# Altium schematic sheet Echode.SchDoc
size A4
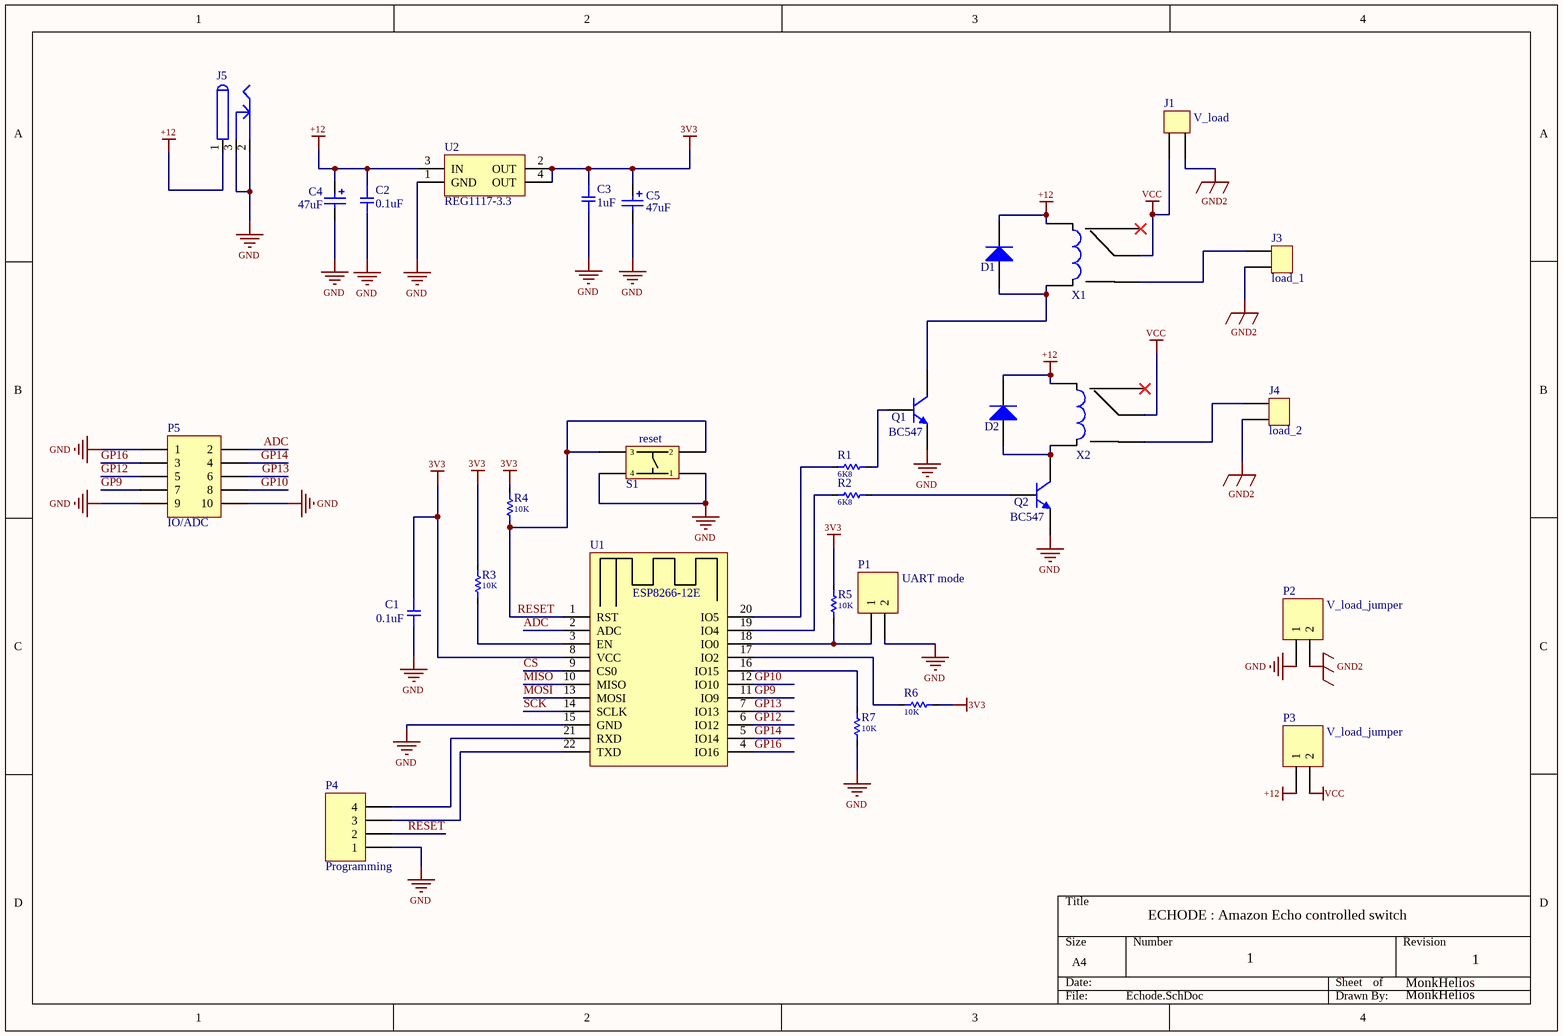
[diagram p0: Echode.SchDoc]

## Parts
C1  0.1uF  [SMD-0805C]
C2  0.1uF  [SMD-0805C]
C3  1uF  [SMD-0805C]
C4  47uF  [PCBComponent_1]
C5  47uF  [PCBComponent_1]
D1  Diode 1N4007  [DO-41]  (value not drawn)
D2  Diode 1N4007  [DO-41]  (value not drawn)
J1  V_load  [Degson_DG126-5.0-02P-14]
J3  load_1  [Degson_DG126-5.0-02P-14]
J4  load_2  [Degson_DG126-5.0-02P-14]
J5  PWR2.5  [KLD-0202]  (value not drawn)
P1  UART mode  [HDR1X2]
P2  V_load_jumper  [HDR1X2]
P3  V_load_jumper  [HDR1X2]
P4  Programming  [HDR1X4]
P5  IO/ADC  [HDR2X5]
Q1  BC547  [SOT-23B_N]
Q2  BC547  [SOT-23B_N]
R1  Component_1  [Resistor_0805]  (value not drawn)
R2  Component_1  [Resistor_0805]  (value not drawn)
R3  Component_1  [Resistor_0805]  (value not drawn)
R4  Component_1  [Resistor_0805]  (value not drawn)
R5  Component_1  [Resistor_0805]  (value not drawn)
R6  Component_1  [Resistor_0805]  (value not drawn)
R7  Component_1  [Resistor_0805]  (value not drawn)
S1  reset  [PCBComponent_1]
U1  ESP8266-12E  [PCBComponent_1]
U2  REG1117-3.3  [ZZ311]
X1  (no value)  [845HN-1C-C]
X2  (no value)  [845HN-1C-C]

## Nets
3V3: C1.1 C3.1 C5.1 R3.2 R4.2 R5.1 R6.1 U1.8(VCC) U2.2(OUT) U2.4(OUT)
+12: C2.1 C4.1 D1.2(K) D2.2(K) J5.1 P3.1 U2.3(IN) X1.1 X2.1
GND: C1.2 C2.2 C3.2 C4.2 C5.2 J5.2 J5.3 P1.2 P2.1 P4.1 P5.1 P5.9 P5.10 Q1.3(E) Q2.3(E) R7.1 S1.1 S1.4 U1.15(GND) U2.1(GND)
GND2: J1.2 J3.2 J4.2 P2.2
VCC: J1.1 P3.2 X1.4 X2.4
ADC: P5.2 U1.2(ADC)
CS: U1.9(CS0)
GP9: P5.7 U1.11(IO9)
GP10: P5.8 U1.12(IO10)
GP12: P5.5 U1.6(IO12)
GP13: P5.6 U1.7(IO13)
GP14: P5.4 U1.5(IO14)
GP16: P5.3 U1.4(IO16)
MISO: U1.10(MISO)
MOSI: U1.13(MOSI)
RESET: P4.2 R4.1 S1.2 S1.3 U1.1(RST)
SCK: U1.14(SCLK)
NetD1_1: D1.1(A) Q1.1(C) X1.2
NetD2_1: D2.1(A) Q2.1(C) X2.2
NetJ3_1: J3.1 X1.5
NetJ4_1: J4.1 X2.5
NetP1_1: P1.1 R5.2 U1.18(IO0)
NetP4_3: P4.3 U1.22(TXD)
NetP4_4: P4.4 U1.21(RXD)
NetQ1_2: Q1.2(B) R1.2
NetQ2_2: Q2.2(B) R2.2
NetR1_1: R1.1 U1.20(IO5)
NetR2_1: R2.1 U1.19(IO4)
NetR3_1: R3.1 U1.3(EN)
NetR6_2: R6.2 U1.17(IO2)
NetR7_2: R7.2 U1.16(IO15)

Not connected (* = marked no-connect by the designer): X1 3*; X2 3*

## Notes on the sheet
- ECHODE : Amazon Echo controlled switch
- 1
- MonkHelios
- (in symbol Component_1) 10K; 6K8

## Library data of the parts
C1-C3 = GC321AD72E103KX01D: CAP CER 10000PF 250V X7T 0805; Manufacturer: Murata Electronics North America; Factory Stock: 0; Unit Price (USD): 0.3; Minimum Quantity: 1; Tolerance: ±10%; Datasheets: http://search.murata.co.jp/Ceramy/image/img/A01X/G101/ENG/GC321AD72E103KX01-01.pdf; Image: //media.digikey.com/Renders/Murata%20Renders/0805(GC3)200x125.jpg; Digi-Key Part Number: 490-13986-1-ND; Part Number: GC321AD72E103KX01D; Quantity Available: 4000; @ qty: 0; Packaging: Cut Tape (CT); Series: GC3; Part Status: Active; Voltage: 250V; Temperature Coefficient: X7T; Operating Temperature: -55°C ~ 125°C; Features: -; Ratings: AEC-Q200; Applications: Automotive; Mounting Type: Surface Mount, MLCC; Package / Case: 0805 (2012 Metric); Size / Dimension: 0.079" L x 0.049" W (2.00mm x 1.25mm); Height - Seated (Max): -; Thickness (Max): 0.039" (1.00mm); Lead Spacing: -; Lead Style: -
  C1 C2: Value: 0.1uF
  C3: Value: 1uF
C4 C5 J1 J3 J4 S1 = Component_1
  C4 C5: VALUE: 47uF
D1 D2 = Diode 1N4007: 1 Amp General Purpose Rectifier; Published: 8-Jun-2000; LatestRevisionDate: 17-Jul-2002; LatestRevisionNote: Re-released for DXP Platform.; DatasheetVersion: 1998; PackageVersion: Aug-1999; PackageReference: DO-41; Publisher: Altium Limited; PackageDescription: Diode, Axial; Body 5.2 x 2.7 mm (LxDia. max), Lead Dia. 0.86 mm (max); Code_JEDEC: DO-204-AL; ComponentLink1Description: Manufacturer Link; ComponentLink1URL: http://www.fairchildsemi.com/; ComponentLink2Description: Datasheet; ComponentLink2URL: http://www.fairchildsemi.com/ds/1N%2F1N4001.pdf
J5 = PWR2.5: Low Voltage Power Supply Connector; Published: 17-Dec-2003; DatasheetDocument: 09-May-2002; Publisher: Altium Limited; ComponentLink1Description: Manufacturer Link; ComponentLink1URL: http://domino.kycon.com/internet/Products.html
P1-P3 = Header 2: Header, 2-Pin; LatestRevisionDate: 17-Jul-2002; LatestRevisionNote: Re-released for DXP Platform.; Publisher: Altium Limited
P4 = Header 4: Header, 4-Pin; LatestRevisionDate: 17-Jul-2002; LatestRevisionNote: Re-released for DXP Platform.; Publisher: Altium Limited
P5 = Header 5X2: Header, 5-Pin, Dual row; LatestRevisionDate: 17-Jul-2002; LatestRevisionNote: Re-released for DXP Platform.; Publisher: Altium Limited
Q1 Q2 = QNPN: NPN Bipolar Transistor; Published: 8-Jun-2000; LatestRevisionDate: 29-May-2009; LatestRevisionNote: IPC-7351 Footprint Added.; PackageVersion: Aug-1999; PackageReference: SOT-23B; Publisher: Altium Limited; PackageDescription: 3-Pin SOT-23 Package 0.95 mm Pitch, 2.4 mm Lead Span
U2 = REG1117-3.3: 800mA and 1A Low Dropout Positive Regulator 2.85V, 3.3V, 5V, and Adjustable; Published: 8-Jun-2000; LatestRevisionDate: 17-Jul-2002; LatestRevisionNote: Re-released for DXP Platform.; DatasheetVersion: Sep-1997; PackageVersion: revC; PackageReference: ZZ311; Publisher: Altium Limited; PackageDescription: SOT-223/SC-73; 4 Leads; Body 6.7 x 7.3 mm, inc. leads (LxW max); ComponentLink1Description: Manufacturer Link; ComponentLink1URL: http://www.ti.com/; ComponentLink2Description: Datasheet; ComponentLink2URL: http://www-s.ti.com/sc/ds/REG1117.pdf
X1 X2 = 845HN-1C-C